# Altium project Placa potência rev. C.PrjPcb
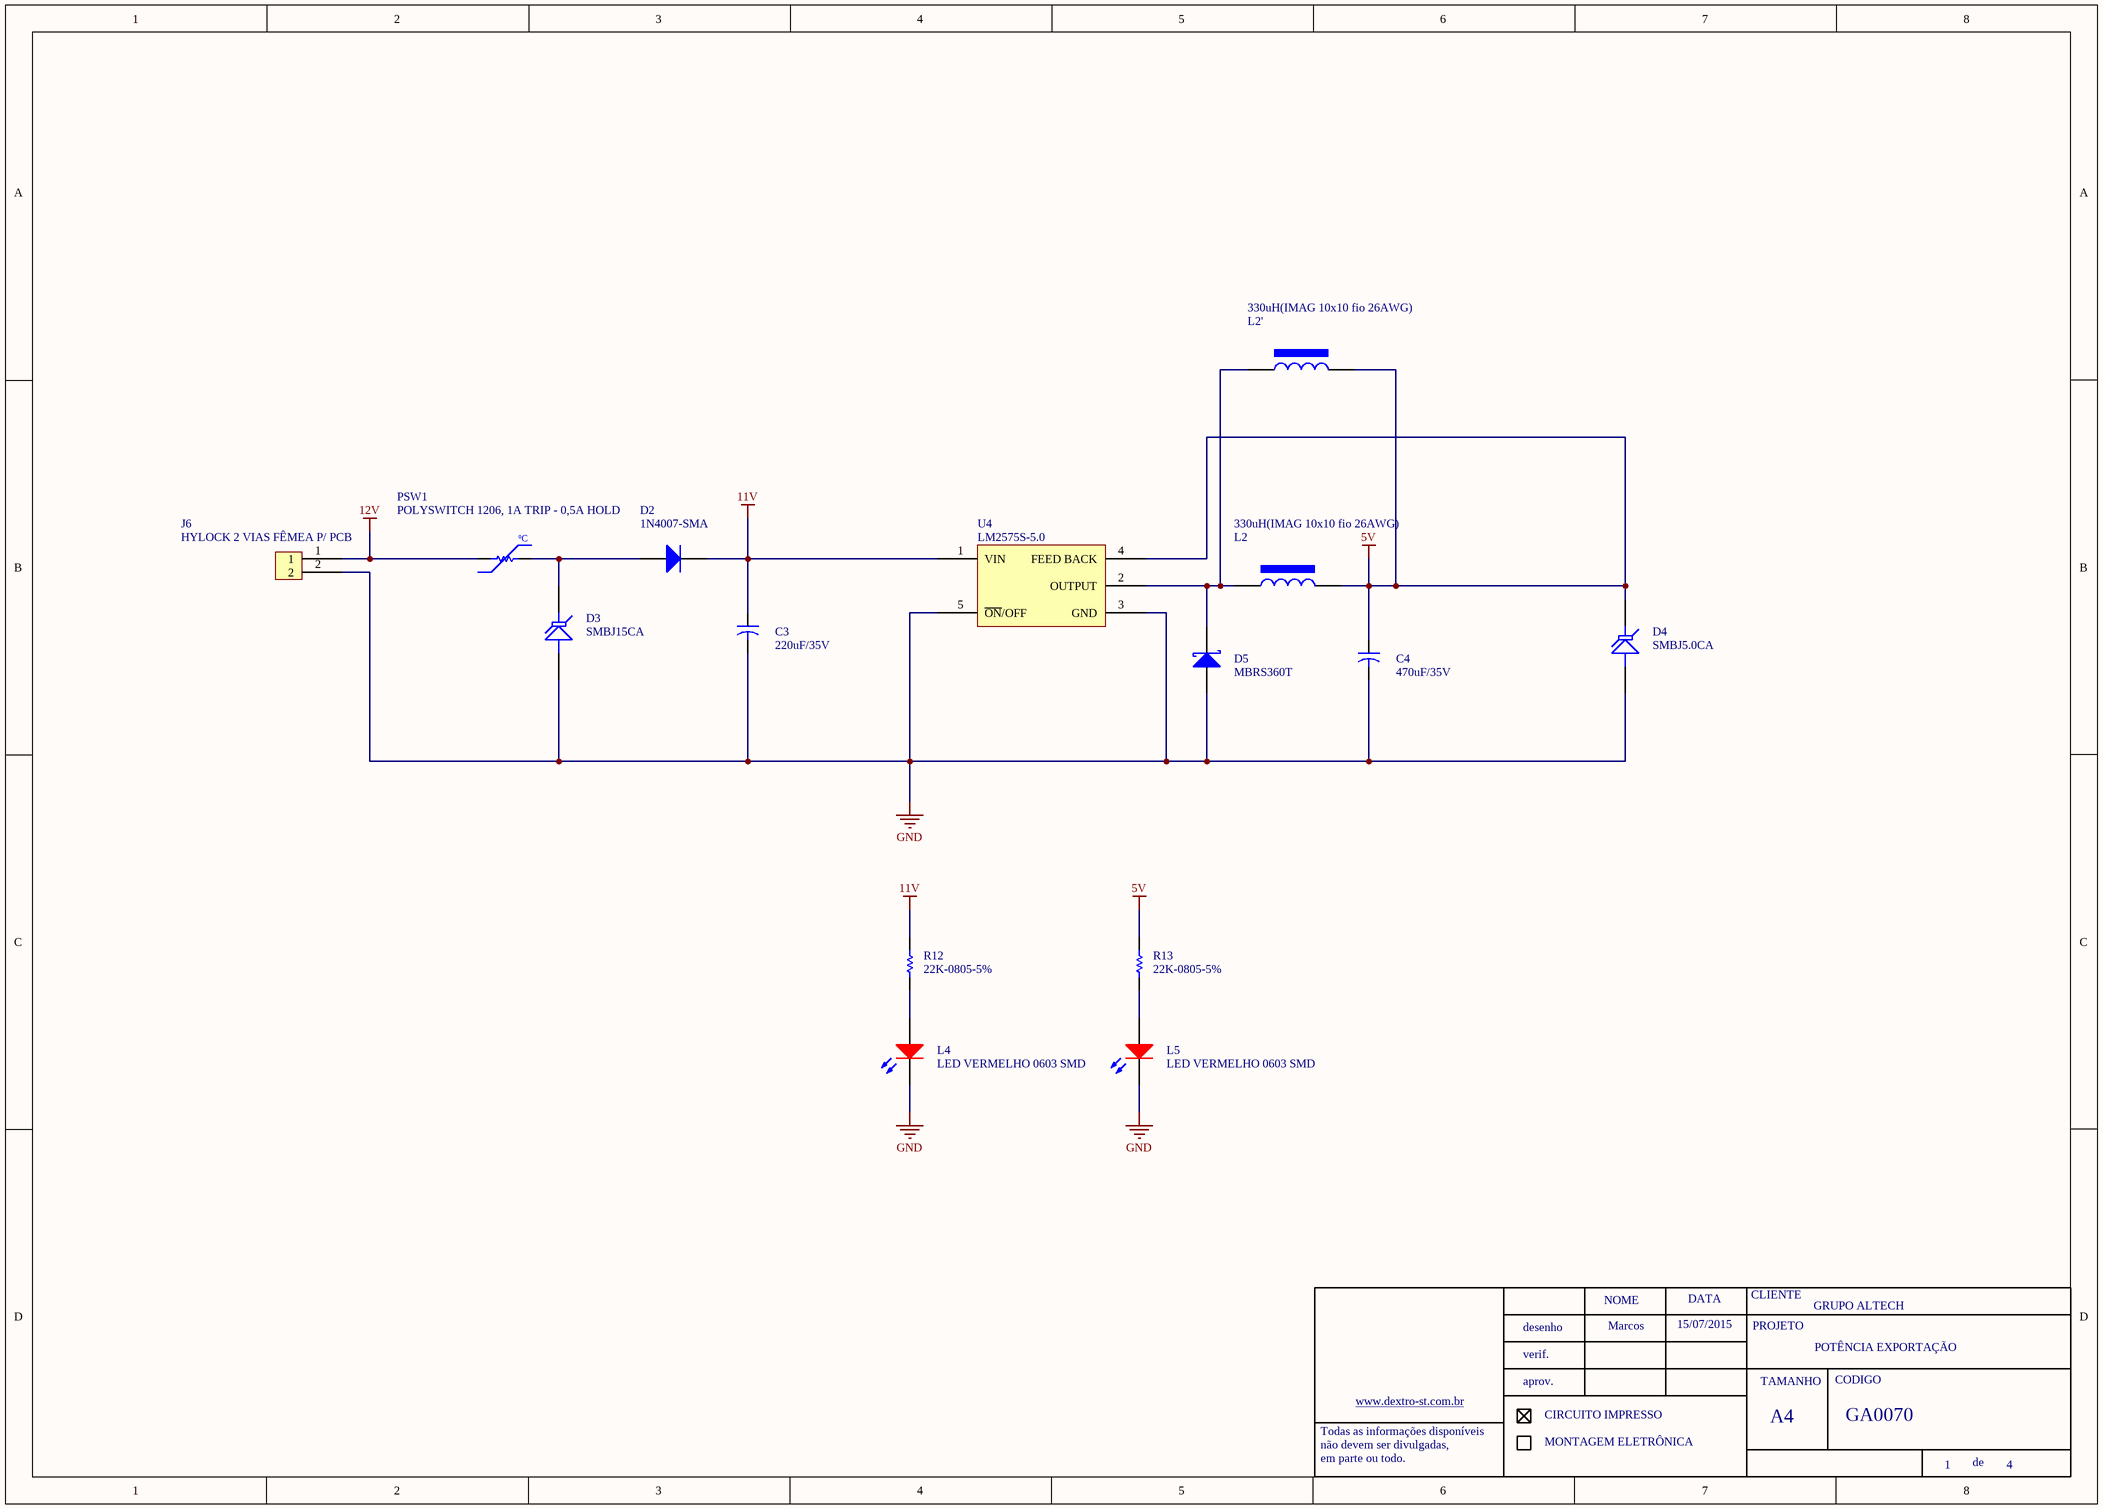
[diagram p0: Regulador.SchDoc]
4 sheets, 62 parts. Net scope: global (net labels, ports and power ports of the same name join across sheets).
Board file: PlacaPotenciaMPG2.PcbDoc
Sheets:
  Regulador.SchDoc
  Sincronismo.SchDoc
  Conectores.SchDoc
  Potencia.SchDoc

## Sheet Regulador.SchDoc: GRUPO ALTECH
size A3; DocumentNumber: GA0070; SheetNumber: 1; SheetTotal: 4

### Parts
C3  220uF/35V  [CAP POL 8x12mm]
C4  470uF/35V  [CAP POL 8x12mm]
D2  1N4007-SMA  [DO-214AA]
D3  SMBJ15CA  [DO-214AA]
D4  SMBJ5.0CA  [DO-214AA]
D5  MBRS360T  [DO-214AA]
J6  HYLOCK 2 VIAS FÊMEA P/ PCB  [CONECTOR HYLOCK 2 VIAS]
L2  330uH(IMAG 10x10 fio 26AWG)  [INDUTOR 47mH]
L2'  330uH(IMAG 10x10 fio 26AWG)  [INDUTOR LOCO]
L4  LED VERMELHO 0603 SMD  [LED 1206]
L5  LED VERMELHO 0603 SMD  [LED 1206]
PSW1  POLYSWITCH 1206, 1A TRIP - 0,5A HOLD  [1206-REVISADO ONDA]
R12  22K-0805-5%  [0805-REVISADO ONDA]
R13  22K-0805-5%  [0805-REVISADO ONDA]
U4  LM2575S-5.0  [TO-263-5]

### Nets
5V: C4.1 D4.2(K) L2.1 L2'.1 R13.2 U4.4(FEED_BACK)
11V: C3.1 D2.2(K) R12.2 U4.1(VIN)
12V: J6.1 PSW1.1
GND: C3.2 C4.2 D3.1(A) D4.1(A) D5.1(A) J6.2 L4.2(K) L5.2(K) U4.3(GND) U4.5(~{ON}/OFF)
NetD2_1: D2.1(A) D3.2(K) PSW1.2
NetD5_2: D5.2(K) L2.2 L2'.2 U4.2(OUTPUT)
NetL4_1: L4.1(A) R12.1
NetL5_1: L5.1(A) R13.1

### Notes on the sheet
- Marcos
- 15/07/2015
- POTÊNCIA EXPORTAÇÃO
- NOME
- DATA
- CLIENTE
- PROJETO
- desenho
- verif.
- aprov.
- TAMANHO
- CODIGO
- Todas as informações disponíveis
- não devem ser divulgadas,
- em parte ou todo.
- www.dextro-st.com.br
- CIRCUITO IMPRESSO
- MONTAGEM ELETRÔNICA
- A4
- de
- (in symbol POLYSWITCH 200mA) ºC

### Library data of the parts
C3 = 2200uF/50V: ERP: 105.01.008
C4 = 470uF/50V: ERP: 105.01.005
D2 = 1N4007: ERP: 120.18.001
D3 = SMBJ30.0A: ERP: 128.02.003
D4 = SMBJ5.0A: ERP: 128.02.002
D5 = 1N5819-SOD80: ERP: 121.18.003
J6 = PCMC2-2
L2 L2' = indutor 1mH CNF15: 1mH-CNF15-26 AWG; ERP: 211.00.012
PSW1 = POLYSWITCH 200mA: NANOSMDC020F-2; ERP: 128.12.002
U4 = LM2596S-ADJ
L4 L5 = LED VERMELHO 0603 SMD: ERP: 124.02.010
R12 R13 = 22K-0805-5%: ERP: 102.11.058

## Sheet Sincronismo.SchDoc: GRUPO ALTECH
size A3; DocumentNumber: GA0070; SheetNumber: 2; SheetTotal: 4; PageSetup: Record=PageOptions|CenterHorizontal=True|CenterVertical=True|PrintScale=0.71|XCorrection=1.00|YCorrection=1.00|PrintKind=0|BorderSize=5000000|LeftOffset=0|BottomOffset=0|Orientation=2|PaperLength=1000|PaperWidth=1000|Scale=100|PaperSource=7|PrintQuality=-3|MediaType=1|DitherType=10|PrintScaleMode=1|PaperKind=A4|PaperIndex=9
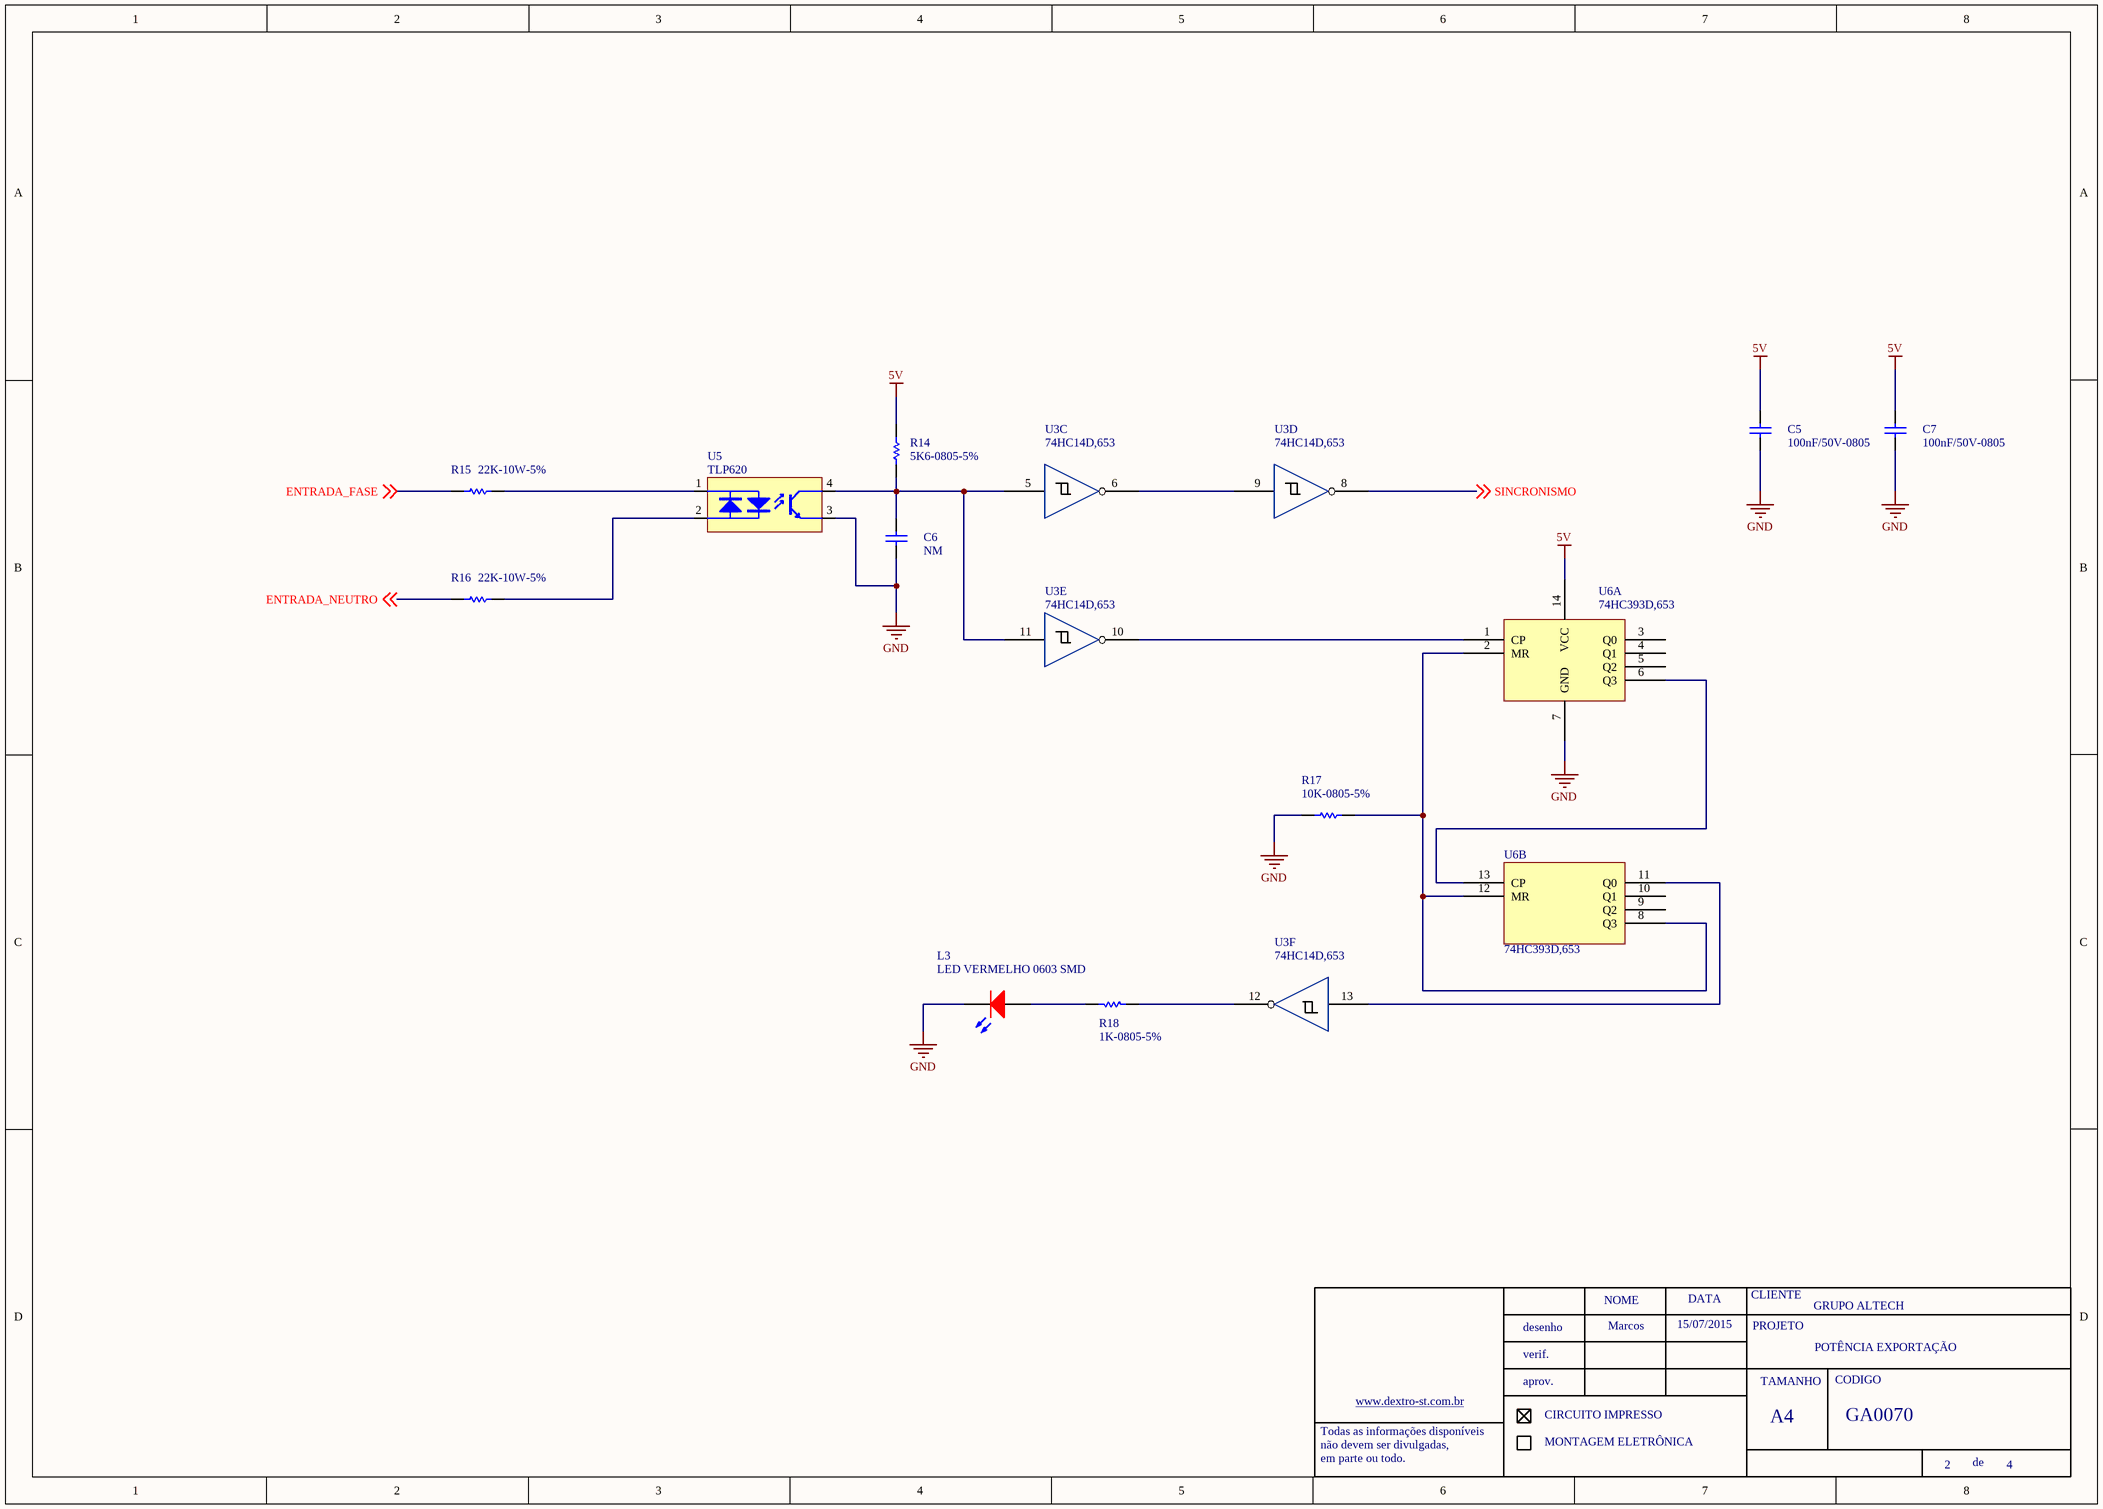
[diagram p1: Sincronismo.SchDoc]

### Parts
C5  100nF/50V-0805  [0805-REVISADO ONDA]
C6  NM  [0805-REVISADO ONDA]
C7  100nF/50V-0805  [0805-REVISADO ONDA]
L3  LED VERMELHO 0603 SMD  [LED 1206]
R14  5K6-0805-5%  [0805-REVISADO ONDA]
R15  22K-10W-5%  [RESISTOR 10W CERAMICO]
R16  22K-10W-5%  [RESISTOR 10W CERAMICO]
R17  10K-0805-5%  [0805-REVISADO ONDA]
R18  1K-0805-5%  [0805-REVISADO ONDA]
U3  74HC14D,653  [SOIC 14 PINOS]  (parts C,D,E,F of 6)
U5  TLP620  [DIP-4]
U6  74HC393D,653  [SOIC 14 PINOS]  (parts A,B of 2)

### Nets
5V: C5.2 C7.2 R14.2 U6.14(VCC)
GND: C5.1 C6.1 C7.1 L3.2(K) R17.1 U5.3(E) U6.7(GND)
ENTRADA_FASE: R15.1 ; off-sheet ENTRADA_FASE
ENTRADA_NEUTRO: R16.1 ; off-sheet ENTRADA_NEUTRO
SINCRONISMO: U3.8 ; off-sheet SINCRONISMO
NetC6_2: C6.2 R14.1 U3.5 U3.11 U5.4(C)
NetL3_1: L3.1(A) R18.2
NetR15_2: R15.2 U5.1(A)
NetR16_2: R16.2 U5.2(K)
NetR17_2: R17.2 U6.2(MR) U6.8(Q3) U6.12(MR)
NetR18_1: R18.1 U3.12
NetU3_6: U3.6 U3.9
NetU3_10: U3.10 U6.1(CP)
NetU3_13: U3.13 U6.11(Q0)
NetU6_6: U6.6(Q3) U6.13(CP)

Not connected (* = marked no-connect by the designer): U6 3(Q0) 4(Q1) 5(Q2) 9(Q2) 10(Q1)

### Notes on the sheet
- Marcos
- 15/07/2015
- POTÊNCIA EXPORTAÇÃO
- NOME
- DATA
- CLIENTE
- PROJETO
- desenho
- verif.
- aprov.
- TAMANHO
- CODIGO
- Todas as informações disponíveis
- não devem ser divulgadas,
- em parte ou todo.
- www.dextro-st.com.br
- CIRCUITO IMPRESSO
- MONTAGEM ELETRÔNICA
- A4
- de

### Library data of the parts
C5-C7 = 100nF/50-0805-NPO: ERP: 104.11.005
R14-R16 = 22K-0805-5%: ERP: 102.11.058
U3 = 74HC14D
U5 = PC814
U6 = 74HC393
L3 = LED VERMELHO 0603 SMD: ERP: 124.02.010
R17 = 10K-0805-5%: ERP: 102.11.054
R18 = 1K-0805-5%: ERP: 102.11.042

## Sheet Conectores.SchDoc: GRUPO ALTECH
size A3; DocumentNumber: GA0070; SheetNumber: 3; SheetTotal: 4
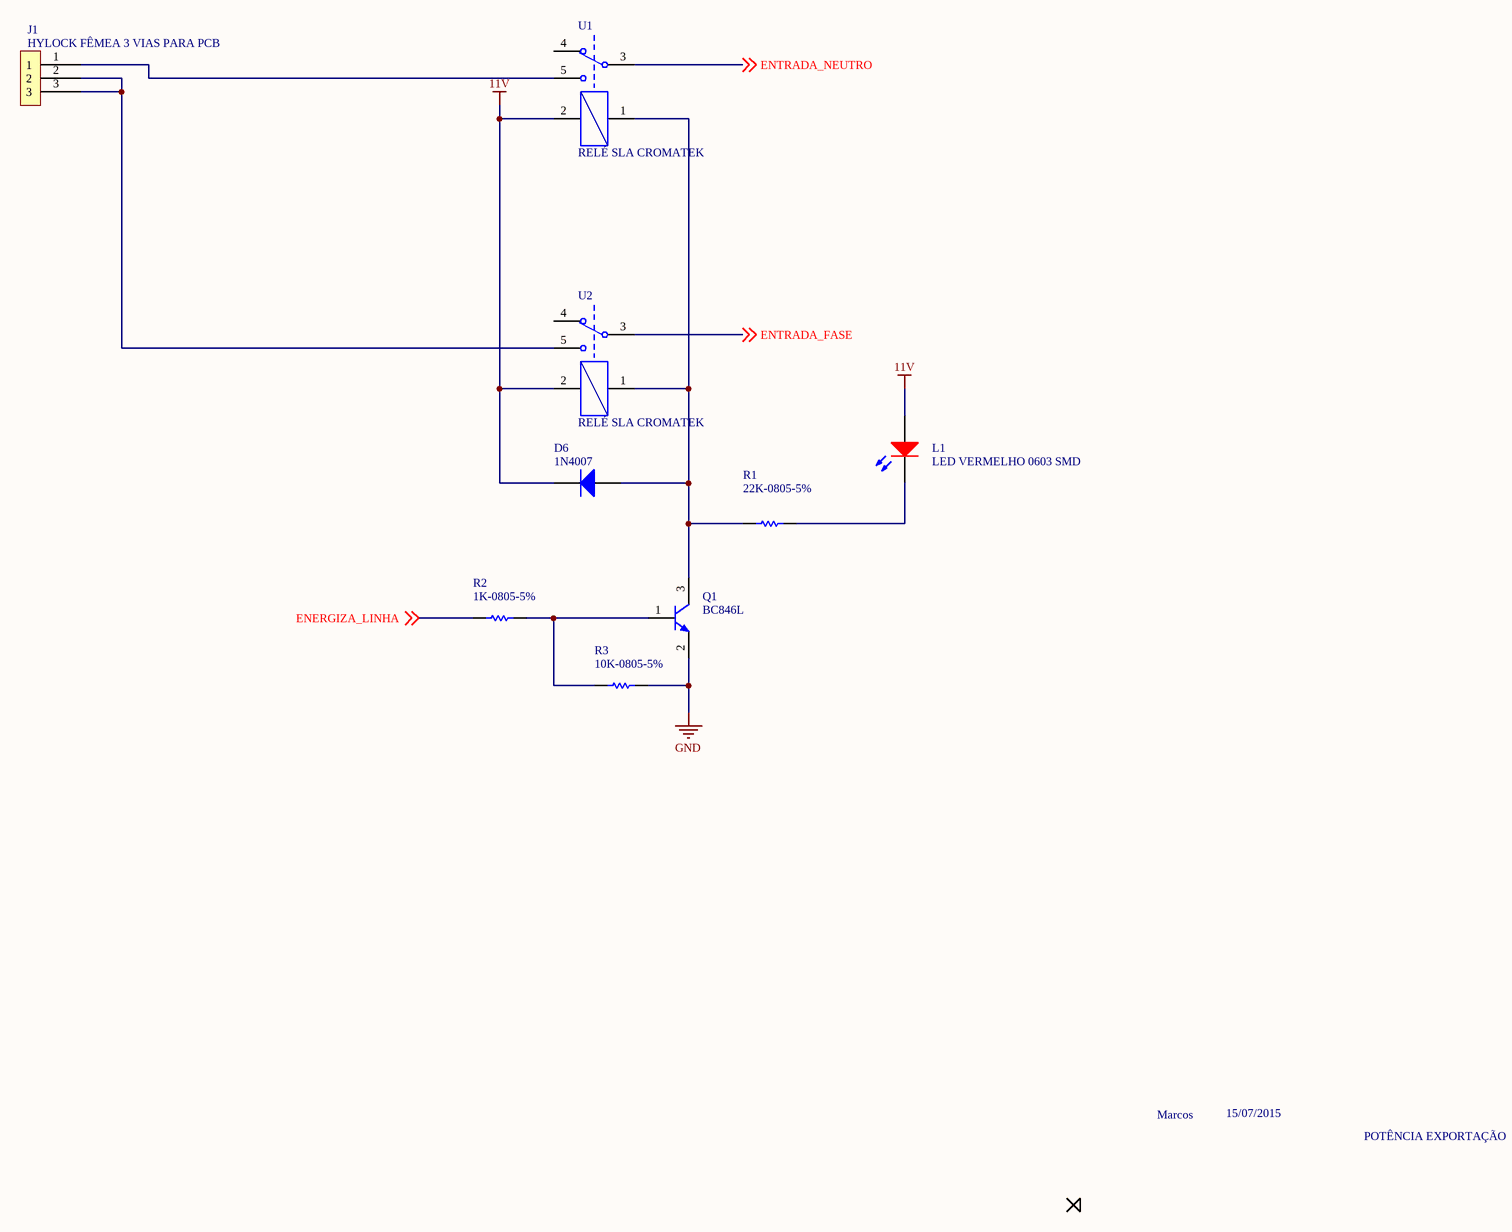
[diagram p2: Conectores.SchDoc]

### Parts
D6  1N4007  [SMA DIODES]
J1  HYLOCK FÊMEA 3 VIAS PARA PCB  [CONECTOR HYLOCK 3 VIAS]
L1  LED VERMELHO 0603 SMD  [LED 1206]
Q1  BC846L  [SOT23 - REVISADO ONDA]
R1  22K-0805-5%  [0805-REVISADO ONDA]
R2  1K-0805-5%  [0805-REVISADO ONDA]
R3  10K-0805-5%  [0805-REVISADO ONDA]
U1  RELÉ SLA CROMATEK  [RELE SLA CROMATEK]
U2  RELÉ SLA CROMATEK  [RELE SLA CROMATEK]

### Nets
11V: D6.2(K) L1.1(A) U1.2(A2) U2.2(A2)
GND: Q1.2(E) R3.2
ENERGIZA_LINHA: R2.1 ; off-sheet ENERGIZA_LINHA
ENTRADA_FASE: U2.3 ; off-sheet ENTRADA_FASE
ENTRADA_NEUTRO: U1.3 ; off-sheet ENTRADA_NEUTRO
NetD6_1: D6.1(A) Q1.3(C) R1.1 U1.1(A1) U2.1(A1)
NetJ1_1: J1.1 U1.5
NetJ1_2: J1.2 J1.3 U2.5
NetL1_2: L1.2(K) R1.2
NetQ1_1: Q1.1(B) R2.2 R3.1

Not connected (* = marked no-connect by the designer): U1 4; U2 4

### Notes on the sheet
- Marcos
- 15/07/2015
- POTÊNCIA EXPORTAÇÃO
- NOME
- DATA
- CLIENTE
- PROJETO
- desenho
- verif.
- aprov.
- TAMANHO
- CODIGO
- Todas as informações disponíveis
- não devem ser divulgadas,
- em parte ou todo.
- www.dextro-st.com.br
- CIRCUITO IMPRESSO
- MONTAGEM ELETRÔNICA
- A4
- de

### Library data of the parts
J1 = PCMC2-3
Q1 = BC846: ERP: 106.22.001
R2 = 10K-0805-5%: ERP: 102.11.054
D6 = 1N4007: ERP: 120.18.001
L1 = LED VERMELHO 0603 SMD: ERP: 124.02.010
R1 = 22K-0805-5%: ERP: 102.11.058
R3 = 10K-0805-5%: ERP: 102.11.054

## Sheet Potencia.SchDoc: GRUPO ALTECH
size A3; DocumentNumber: GA0070; SheetNumber: 4; SheetTotal: 4
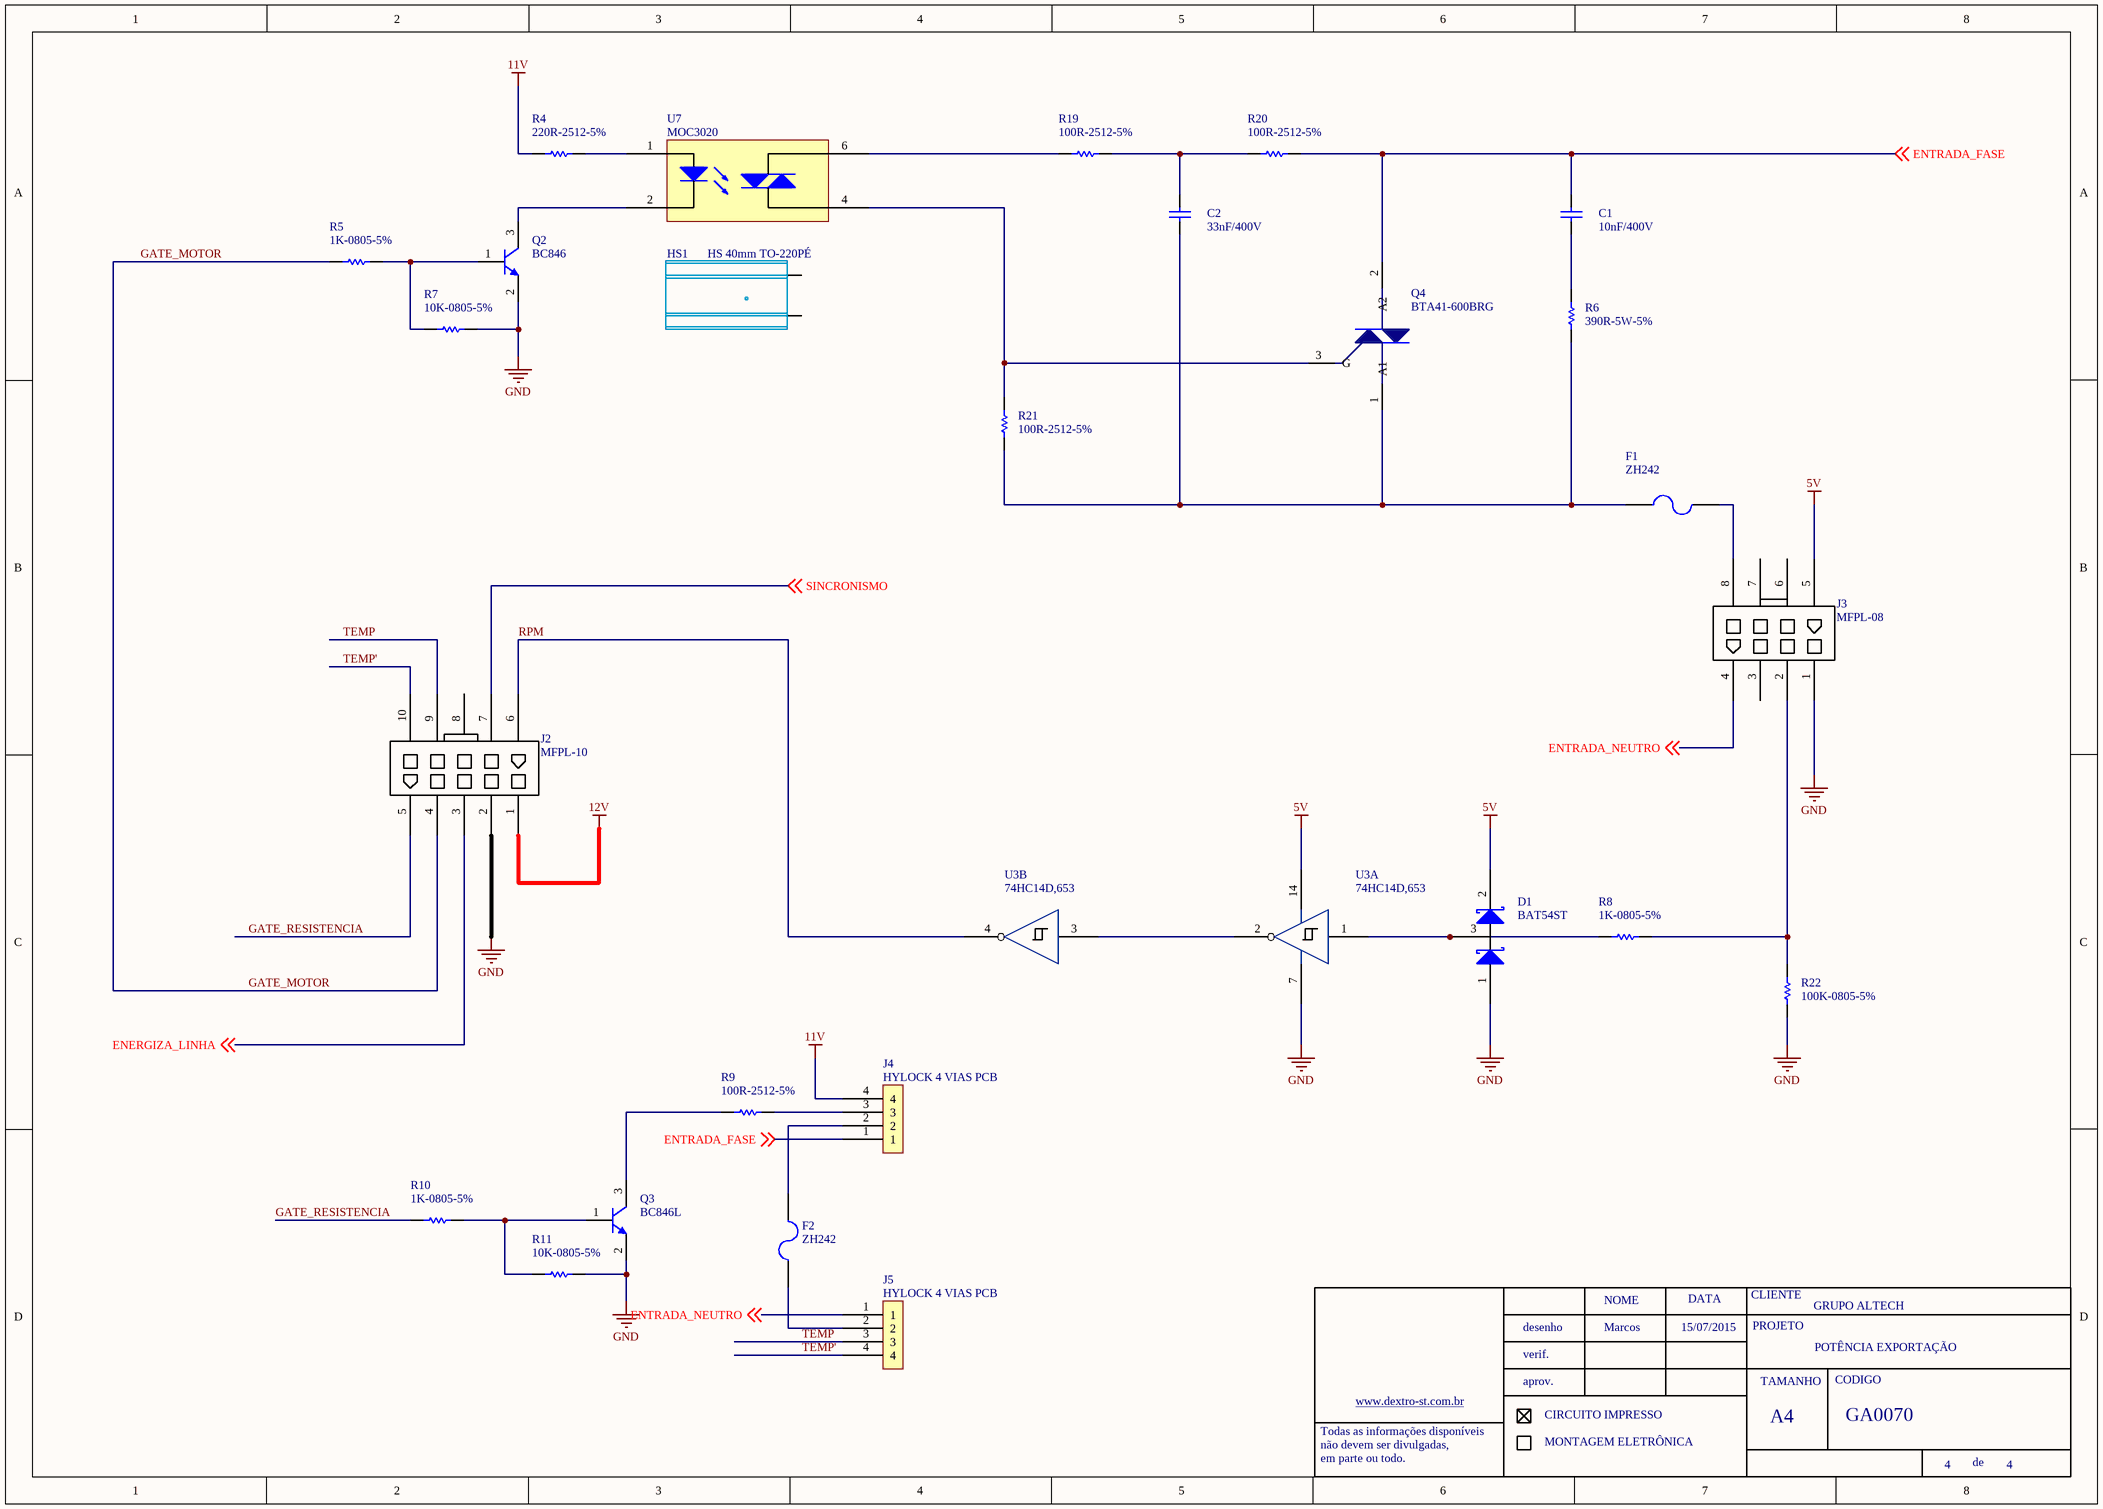
[diagram p3: Potencia.SchDoc]

### Parts
C1  10nF/400V  [cap 330nF/250V]
C2  33nF/400V  [cap 330nF/250V]
D1  BAT54ST  [SOT23 - REVISADO ONDA]
F1  ZH242  [ZH242_REVISADO]
F2  ZH242  [ZH242_REVISADO]
HS1  HS 40mm TO-220PÉ  [dissipador grande]
J2  MFPL-10  [MFPC-10]
J3  MFPL-08  [MFPC-08]
J4  HYLOCK 4 VIAS PCB  [CONECTOR HYLOK 4 VIAS]
J5  HYLOCK 4 VIAS PCB  [CONECTOR HYLOK 4 VIAS]
Q2  BC846  [SOT23 - REVISADO ONDA]
Q3  BC846L
Q4  BTA41-600BRG  [TO-247 - duplicate]
R4  220R-2512-5%  [2512 - REVISADO ONDA]
R5  1K-0805-5%  [0805-REVISADO ONDA]
R6  390R-5W-5%  [RESISTOR 5W FIO]
R7  10K-0805-5%  [0805-REVISADO ONDA]
R8  1K-0805-5%  [0805-REVISADO ONDA]
R9  100R-2512-5%  [2512 - REVISADO ONDA]
R10  1K-0805-5%  [0805-REVISADO ONDA]
R11  10K-0805-5%  [0805-REVISADO ONDA]
R19  100R-2512-5%  [2512 - REVISADO ONDA]
R20  100R-2512-5%  [2512 - REVISADO ONDA]
R21  100R-2512-5%  [2512 - REVISADO ONDA]
R22  100K-0805-5%  [0805-REVISADO ONDA]
U3  74HC14D,653  [SOIC 14 PINOS]  (parts A,B of 6)
U7  MOC3020  [dip6]

### Nets
5V: D1.2 J3.5 U3.14(VCC)
11V: J4.4 R4.2
12V: J2.1
GND: D1.1 J2.2 J3.1 Q2.2(E) Q3.2(E) R7.2 R11.2 R22.1 U3.7(GND)
ENERGIZA_LINHA: J2.3 ; off-sheet ENERGIZA_LINHA
ENTRADA_FASE: C1.2 J4.1 Q4.2(A2) R20.2 ; off-sheet ENTRADA_FASE
ENTRADA_NEUTRO: J3.4 J5.1 ; off-sheet ENTRADA_NEUTRO
GATE_MOTOR: J2.4 R5.1
GATE_RESISTENCIA: J2.5 R10.1
RPM: J2.6 U3.4
SINCRONISMO: J2.7 ; off-sheet SINCRONISMO
TEMP: J2.9 J5.3
TEMP': J2.10 J5.4
NetC1_1: C1.1 R6.1
NetC2_1: C2.1 F1.2 Q4.1(A1) R6.2 R21.1
NetC2_2: C2.2 R19.2 R20.1
NetD1_3: D1.3 R8.1 U3.1
NetF1_1: F1.1 J3.8
NetF2_1: F2.1 J4.2
NetF2_2: F2.2 J5.2
NetJ3_2: J3.2 R8.2 R22.2
NetJ4_3: J4.3 R9.2
NetQ2_1: Q2.1(B) R5.2 R7.1
NetQ2_3: Q2.3(C) U7.2
NetQ3_1: Q3.1(B) R10.2 R11.1
NetQ3_3: Q3.3(C) R9.1
NetQ4_3: Q4.3(G) R21.2 U7.4
NetR4_1: R4.1 U7.1
NetR19_1: R19.1 U7.6
NetU3_2: U3.2 U3.3

Not connected (* = marked no-connect by the designer): HS1 0 1; J2 8; J3 3 6 7

### Notes on the sheet
- Marcos
- 15/07/2015
- POTÊNCIA EXPORTAÇÃO
- NOME
- DATA
- CLIENTE
- PROJETO
- desenho
- verif.
- aprov.
- TAMANHO
- CODIGO
- Todas as informações disponíveis
- não devem ser divulgadas,
- em parte ou todo.
- www.dextro-st.com.br
- CIRCUITO IMPRESSO
- MONTAGEM ELETRÔNICA
- A4
- de

### Library data of the parts
C1 C2 = 100nF/50-0805-NPO: ERP: 104.11.005
F1 F2 = PORTA FUSÍVEL TIPO BERÇO: ERP: 426.00.002
HS1 = DISSIPADOR 40mm PÉ
J4 J5 = PCMC2-4
Q2 = BC846: BC846L; ERP: 106.22.001
Q3 = BC846: ERP: 106.22.001
R5 = 10K-0805-5%: ERP: 102.11.054
R6 = 47R-5W-5%: ERP: 103.16.005
R9 = 100R-0805-5%: ERP: 102.11.031
R19-R21 = 220R-2512-5%: ERP: 102.31.000
U3 = 74HC14D
R4 = 220R-2512-5%: ERP: 102.31.000
R7 R11 = 10K-0805-5%: ERP: 102.11.054
R8 R10 = 1K-0805-5%: ERP: 102.11.042
R22 = 100K-0805-5%: ERP: 102.11.066

## Nets that join several sheets
5V: Regulador (6 pins), Sincronismo (C5.2 C7.2 R14.2 U6.14), Potencia (D1.2 J3.5 U3.14)
11V: Regulador (C3.1 D2.2 R12.2 U4.1), Conectores (D6.2 L1.1 U1.2 U2.2), Potencia (J4.4 R4.2)
12V: Regulador (J6.1 PSW1.1), Potencia (J2.1)
GND: Regulador (10 pins), Sincronismo (7 pins), Conectores (Q1.2 R3.2), Potencia (9 pins)
ENERGIZA_LINHA: Conectores (R2.1), Potencia (J2.3)
ENTRADA_FASE: Sincronismo (R15.1), Conectores (U2.3), Potencia (C1.2 J4.1 Q4.2 R20.2)
ENTRADA_NEUTRO: Sincronismo (R16.1), Conectores (U1.3), Potencia (J3.4 J5.1)
SINCRONISMO: Sincronismo (U3.8), Potencia (J2.7)